# EAGLE design Status_Board (EAGLE 9.6.2)
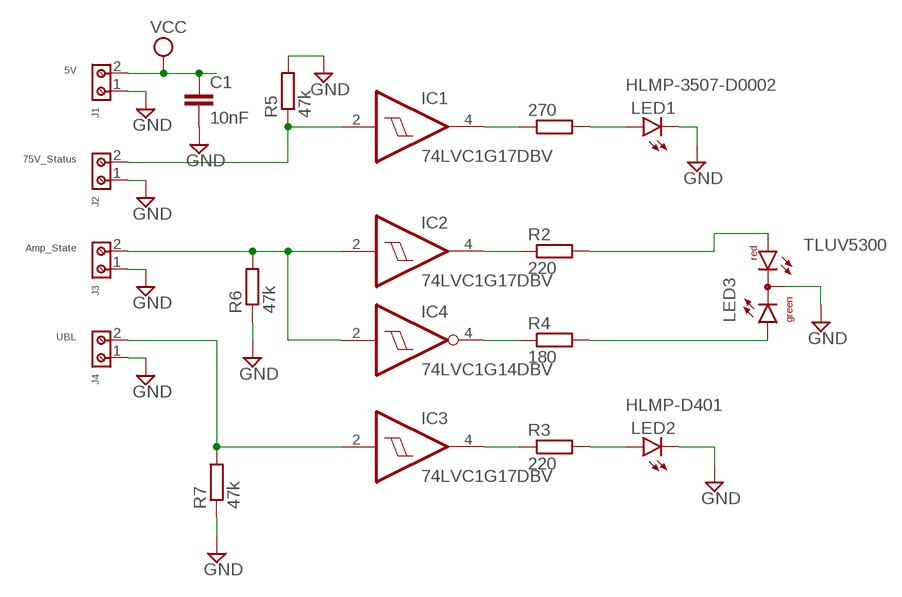
[diagram p0: schematic, sheet 1]

## Parts
270  R-EU_R0805  [R0805]
C1  10nF  C-EUC0805  [C0805]
IC1  74LVC1G17DBV  [SOT23-5]
IC2  74LVC1G17DBV  [SOT23-5]
IC3  74LVC1G17DBV  [SOT23-5]
IC4  74LVC1G14DBV  [SOT23-5]
J1  5V  691210910002  [691210910002]
J2  75V_Status  691210910002  [691210910002]
J3  Amp_State  691210910002  [691210910002]
J4  UBL  691210910002  [691210910002]
LED1  LED5MM  [LED5MM]
LED2  LED5MM  [LED5MM]
LED3  DUOLED-RG-C  [DUOLED-C-5MM]
R2  220  R-EU_R0805  [R0805]
R3  220  R-EU_R0805  [R0805]
R4  180  R-EU_R0805  [R0805]
R5  47k  R-EU_R0805  [R0805]
R6  47k  R-EU_R0805  [R0805]
R7  47k  R-EU_R0805  [R0805]

## Nets
GND: C1.2 J1.1 J2.1 J3.1 J4.1 LED1.K(C) LED2.K(C) LED3.C R5.2 R6.1 R7.1
N$1: IC4.4(O) R4.1
N$2: IC1.2(I) J2.2 R5.1
N$3: IC2.2(I) IC4.2(I) J3.2 R6.2
N$4: IC3.2(I) J4.2 R7.2
N$5: 270.1 IC1.4(O)
N$6: IC2.4(O) R2.1
N$7: IC3.4(O) R3.1
N$8: 270.2 LED1.A
N$9: LED3.AR R2.2
N$10: LED2.A R3.2
N$11: LED3.AX(AG) R4.2
VCC: C1.1 J1.2

## Notes on the sheet
- HLMP-3507-D0002
- TLUV5300
- HLMP-D401

## Power pins joined to a net without a drawn wire
GND: IC1.3(GND) IC2.3(GND) IC3.3(GND) IC4.3(GND)
VCC: IC1.5(VCC) IC2.5(VCC) IC3.5(VCC) IC4.5(VCC)

## Library data of the parts
270 R2-R7 = rcl:R-EU_: RESISTOR, European symbol; SPICEPREFIX: R
C1 = rcl:C-EU: CAPACITOR, European symbol; SPICEPREFIX: C
IC1-IC3 = 74xx-little-us:74*1G17: Single Schmitt-Trigger Buffer
IC4 = 74xx-little-us:74*1G14: Single Schmitt-Trigger Inverter Gate
J1-J4 = Wurth_Connectors_WR-TBL Rising Cage Clamp:691210910002: WR-TBL Serie 2109 - 2.54 mm Horiz. Entry KIND PROPERTIES Pitch 2.54 mm MATERIAL PROPERTIES Insulator Material PA66 Insulator Flammability Rating UL94 V-0 Insulator Color Green Contact Material Brass Contact Plating Copper over Zinc Terminal Screw Material Steel Terminal Screw Plating Zinc Wire Guard Material Brass GENERAL INFORMATION Operating Temperature -40 up to +105 °C Compliance Lead free / RoHS ELECTRICAL PROPERTIES IR cULus 6 A Working Voltage [cULus] 150 V (AC) Withstanding Voltage [cULus] 1300 V (AC) Contact Resistance [cULus] 20 mΩ MECHANICAL PROPERTIES Wire Strip Length 4 up to 5 (mm) Screw M1.6 Solid Wire Section (AWG) 30 to 18 (AWG) Solid Wire Section (Metric) 0.0509 to 0.823 (mm²) Stranded Wire Section (AWG) 30 to 18 (AWG) Stranded Wire Section (Metric) 0.0509 to 0.823 (mm²) CERTIFICATION cULus Approval E315414 PACKAGING PROPERTIES Packaging Box <https://katalog.we-online.com/media/images/v2/o33231v209%20Family_WR-TBL_69121091000x.jpg> Details see: https://katalog.we-online.com/en/em/TBL_2_54_2109_HORIZONTAL_ENTRY_69121091000X Updated by Ella Wu 2019-11-12 2019(C) Wurth Elektronik; DATASHEET-URL: https://www.we-online.com/catalog/datasheet/691210910002.pdf; IR-UL: 6A; MOUNT: THT; PART-NUMBER: 691210910002; PINS: 2; PITCH: 2.54mm; TYPE: Horizontal; WIRE: 30 to 18 (AWG) 0.0509 to 0.823 (mm²); WORKING-VOLTAGE-UL: 150V (AC)
LED1 LED2 = led:LED: LED OSRAM: - CHIPLED LG R971, LG N971, LY N971, LG Q971, LY Q971, LO R971, LY R971 LH N974, LH R974 LS Q976, LO Q976, LY Q976 LO Q996 - Hyper CHIPLED LW Q18S LB Q993, LB Q99A, LB R99A - SideLED LS A670, LO A670, LY A670, LG A670, LP A670 LB A673, LV A673, LT A673, LW A673 LH A674 LY A675 LS A676, LA A676, LO A676, LY A676, LW A676 LS A679, LY A679, LG A679 - Hyper Micro SIDELED® LS Y876, LA Y876, LO Y876, LY Y876 LT Y87S - SmartLED LW L88C, LW L88S LB L89C, LB L89S, LG L890 LS L89K, LO L89K, LY L89K LS L896, LA L896, LO L896, LY L896 - TOPLED LS T670, LO T670, LY T670, LG T670, LP T670 LSG T670, LSP T670, LSY T670, LOP T670, LYG T670 LG T671, LOG T671, LSG T671 LB T673, LV T673, LT T673, LW T673 LH T674 LS T676, LA T676, LO T676, LY T676, LB T676, LH T676, LSB T676, LW T676 LB T67C, LV T67C, LT T67C, LS T67K, LO T67K, LY T67K, LW E67C LS E67B, LA E67B, LO E67B, LY E67B, LB E67C, LV E67C, LT E67C LW T67C LS T679, LY T679, LG T679 LS T770, LO T770, LY T770, LG T770, LP T770 LB T773, LV T773, LT T773, LW T773 LH T774 LS E675, LA E675, LY E675, LS T675 LS T776, LA T776, LO T776, LY T776, LB T776 LHGB T686 LT T68C, LB T68C - Hyper Mini TOPLED® LB M676 - Mini TOPLED Santana® LG M470 LS M47K, LO M47K, LY M47K Source: http://www.osram.convergy.de LUXEON: - LUMILED® LXK2-PW12-R00, LXK2-PW12-S00, LXK2-PW14-U00, LXK2-PW14-V00 LXK2-PM12-R00, LXK2-PM12-S00, LXK2-PM14-U00 LXK2-PE12-Q00, LXK2-PE12-R00, LXK2-PE12-S00, LXK2-PE14-T00, LXK2-PE14-U00 LXK2-PB12-K00, LXK2-PB12-L00, LXK2-PB12-M00, LXK2-PB14-N00, LXK2-PB14-P00, LXK2-PB14-Q00 LXK2-PR12-L00, LXK2-PR12-M00, LXK2-PR14-Q00, LXK2-PR14-R00 LXK2-PD12-Q00, LXK2-PD12-R00, LXK2-PD12-S00 LXK2-PH12-R00, LXK2-PH12-S00 LXK2-PL12-P00, LXK2-PL12-Q00, LXK2-PL12-R00 Source: www.luxeon.com KINGBRIGHT: KA-3528ASYC Source: www.kingbright.com
LED3 = led:DUOLED-RG-C: DUO LED 2 colors (red/green), 5 mm, round, common Cathode www.ligitek.com or other producers.

## Board
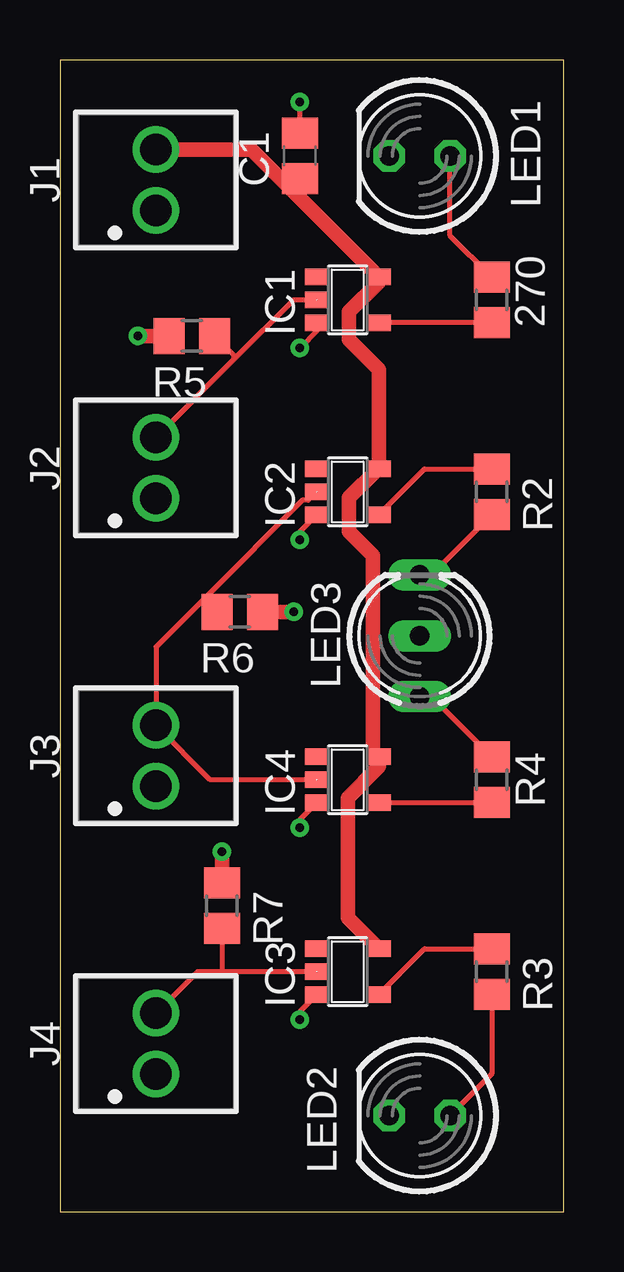
[diagram p1: board, top side]
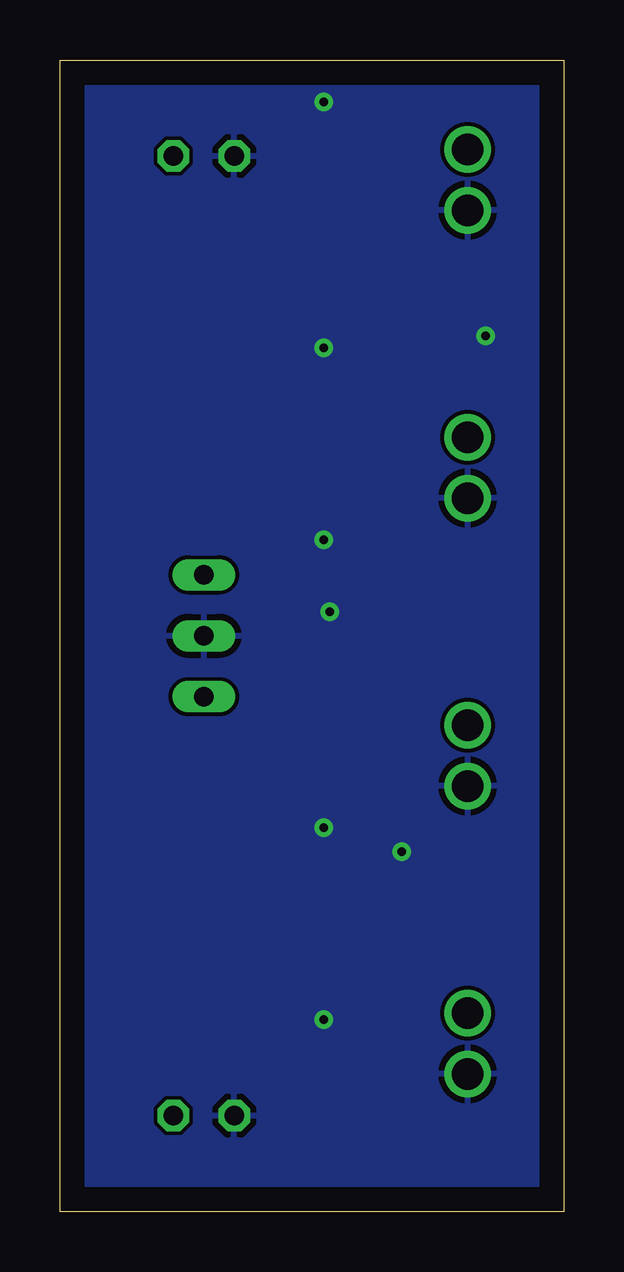
[diagram p2: board, bottom side, seen from below]

Size 21 x 48 mm. Coordinates in mm from the lower left corner, seen from the top.
Outline: 0,0 21,0 21,48 0,48 0,0
Copper layers (1*16): Top 0.035mm / dielectric 1.5mm / Bottom 0.035mm
Design rules "default": minimum track width 6mil, minimum drill 0.35mm, track to track 6mil, track to pad 6mil, pad to pad 6mil, via to via 6mil, smd to smd 6mil, copper to edge 40mil, drill to drill 6mil, minimum pad ring 10mil, minimum via ring 8mil, stop-mask expansion 4mil, vias tented up to drill 0mil, thermal gap 10mil

### Footprints (pad centres in the part's own frame; a part is rotated, then mirrored left to right if it is on the bottom)
R0805 = smd 1.3 x 1.5: 1 -0.95,0; 2 0.95,0
C0805 = smd 1.3 x 1.5: 1 -0.95,0; 2 0.95,0
SOT23-5 = smd 0.69 x 0.99: 1 -0.95,-1.29; 2 0,-1.29; 3 0.95,-1.29; 4 0.95,1.3; 5 -0.95,1.3
691210910002 = drill 1.3: 1 -1.27,0; 2 1.27,0
LED5MM = drill 0.813 octagon: A -1.27,0; K 1.27,0
DUOLED-C-5MM = drill 0.813 long: AR 2.54,0; AX -2.54,0; C 0,0

### Placement (x,y rotation side)
270  18,38 90 top
C1  10,44 90 top
IC1  12,38 270 top
IC2  12,30 270 top
IC3  12,10 270 top
IC4  12,18 270 top
J1  4,43 90 top
J2  4,31 90 top
J3  4,19 90 top
J4  4,7 90 top
LED1  15,44 180 top
LED2  15,4 180 top
LED3  15,24 90 top
R2  18,30 270 top
R3  18,10 270 top
R4  18,18 90 top
R5  5.5,36.5 180 top
R6  7.5,25 180 top
R7  6.75,12.75 270 top

### Tracks (layer width: path | path; a pad name or v marks a point on that pad's centre or on a via)
GND  (via drill 0.35)
  Top 0.203: IC1.3 10.71,36.71 v10,36 | IC3.3 10,8.34 v10,8 | IC4.3 10,16.34 v10,16 | IC2.3 10,28.34 v10,28 | C1.2 v10,46.25
  Top 0.61: R5.2 v3.25,36.5 | R6.1 v9.75,25 | R7.1 v6.75,15
  pour Bottom: 1,47 1,1 20,1 20,47
N$1
  Top 0.203: IC4.4 R4.1
N$2
  Top 0.2: R5.1 7.24,35.71 7.24,35.51
  Top 0.203: IC1.2 9.73,38 7.24,35.51 J2.2
N$3
  Top 0.2: R6.2 6.11,25.45 6.11,25.64
  Top 0.203: IC2.2 10.36,29.65 10.11,29.65 6.11,25.64 4,23.54 J3.2 6.27,18 IC4.2
N$4
  Top 0.2: R7.2 6.75,10
  Top 0.203: IC3.2 6.75,10 5.73,10 J4.2
N$5
  Top 0.203: 270.1 IC1.4
N$6
  Top 0.203: IC2.4 15.2,30.95 R2.1
N$7
  Top 0.203: IC3.4 15.2,10.95 R3.1
N$8
  Top 0.203: 270.2 16.27,40.68 LED1.A
N$9
  Top 0.2: LED3.AR 15.49,26.54
  Top 0.203: 15.49,26.54 R2.2
N$10
  Top 0.203: R3.2 18,5.73 LED2.A
N$11
  Top 0.2: R4.2 15.49,21.46 LED3.AX
VCC
  Top 0.203: IC4.5 13.3,18.55 | C1.1 10,43 9.62,42.62
  Top 0.61: J1.2 7.98,44.27 9.62,42.62 IC1.5 13.3,38.75 12.05,37.5 12.05,36.35 13.3,35.1 IC2.5 13.25,30.95 12.05,29.75 12.05,28.35 13.05,27.35 13.05,19.2 IC4.5 | 13.3,18.55 12,17.25 12,12.25 IC3.5